# Altium schematic sheet Mobile_device_sheet6_interfaces.SchDoc
size A4; SheetNumber: 5; SheetTotal: 5
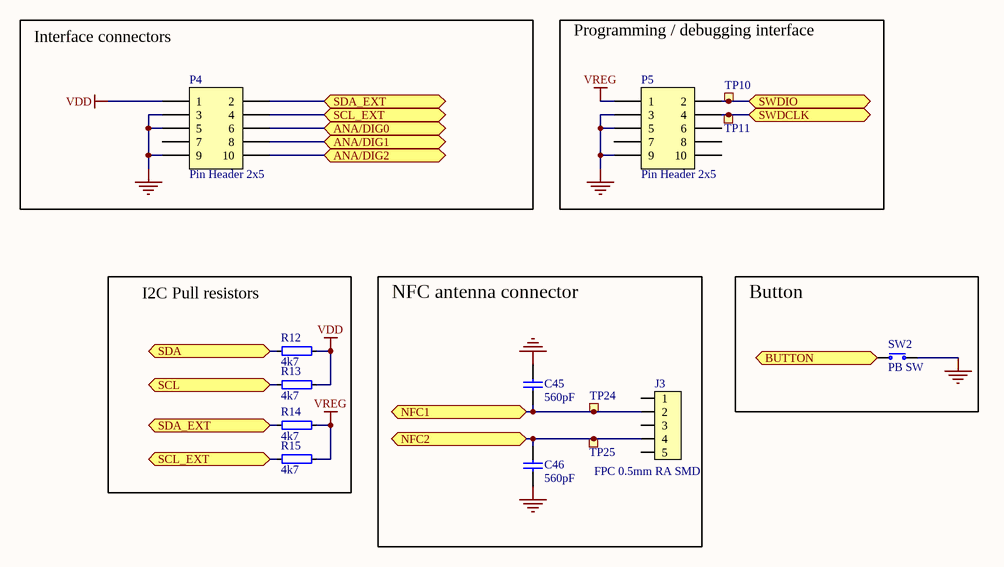
[diagram p0: Mobile_device_sheet6_interfaces.SchDoc]

## Parts
C45  560pF  [CAPC1005X04L]
C46  560pF  [CAPC1005X04L]
J3  FPC 0.5mm RA SMD  [FPC_05P-0.5mm-RA-SMD]
P4  Pin Header 2x5  [HDR_2x5-SMD-1.27mm-ANG]
P5  Pin Header 2x5  [HDR_2x5-SMD-1.27mm-ANG]
R12  4k7  [RESC1005X04L]
R13  4k7  [RESC1005X04L]
R14  4k7  [RESC1005X04L]
R15  4k7  [RESC1005X04L]
SW2  PB SW  [Switch-PB-6.2x6.3mm-SMD]
TP10  Ø1.5mm,SMD  [TP_SMD_Ø1.5mm]  (value not drawn)  (no BOM)
TP11  Ø1.5mm,SMD  [TP_SMD_Ø1.5mm]  (value not drawn)  (no BOM)
TP24  Ø1.0mm,SMD  [TP_SMD_Ø1.0mm]  (value not drawn)  (no BOM)
TP25  Ø1.0mm,SMD  [TP_SMD_Ø1.0mm]  (value not drawn)  (no BOM)

## Blocks framed on the sheet
Interface connectors: P4
Programming / debugging interface: P5 TP10 TP11
I2C Pull resistors: R12-R15
NFC antenna connector: C45 C46 J3 TP24 TP25
Button: SW2

## Ports
ANA/DIG0 (bidir), ANA/DIG1 (bidir), ANA/DIG2 (bidir), BUTTON (bidir), NFC1 (bidir), NFC2 (bidir), SCL (bidir), SCL_EXT (bidir), SDA (bidir), SDA_EXT (bidir), SWDCLK (bidir), SWDIO (bidir)

## Nets
GND: C45.2 C46.1 P4.3 P4.5 P4.9 P5.3 P5.5 P5.9 SW2.1(N.O)
VDD: P4.1 R12.1 R13.1
VREG: P5.1 R14.1 R15.1
ANA/DIG0: P4.6 ; port ANA/DIG0
ANA/DIG1: P4.8 ; port ANA/DIG1
ANA/DIG2: P4.10 ; port ANA/DIG2
BUTTON: SW2.2(COM) ; port BUTTON
NFC1: C45.1 J3.2 TP24.1 ; port NFC1
NFC2: C46.2 J3.4 TP25.1 ; port NFC2
SCL: R13.2 ; port SCL
SCL_EXT: P4.4 R15.2 ; port SCL_EXT
SDA: R12.2 ; port SDA
SDA_EXT: P4.2 R14.2 ; port SDA_EXT
SWDCLK: P5.4 TP11.1 ; port SWDCLK
SWDIO: P5.2 TP10.1 ; port SWDIO

Not connected (* = marked no-connect by the designer): J3 1 3 5; P4 7; P5 6 7 8 10

## Library data of the parts
C45 C46 = C0402-560p: Capacitor, NP0, ±5%; Part number IPS: N.A.; Note: 50V; Artikkelnr Noca: 20029161; Part Number: C0402-560p; Manufacturer: *; Manufacturer Part Number: *; Footprint Doc: 0402; LatestRevisionDate: 2009-05-08; Pin Count: 2; Publisher: Nordic Semiconductor; Published: 2009-05-08; Value: 560pF; ComponentLink1URL: *; ComponentLink1Description: Datasheet; ComponentLink2URL: *; ComponentLink2Description: Supplier link; HelpURL: *; Supplier 1: *; Supplier Part Number 1: *; Supplier 2: *; Supplier Part Number 2: *
J3 = FPC_05P-0.5mm-RA-SMD: 0.5mm FPC, 5P,Right Angle SMT,Double Contact,H=1.2mm,White, Tin plated; Manufacturer: W-CON; Manufacturer Part Number: 5141-05RZDNWR01; Part number IPS: 00000007792; Artikkelnr Noca: 55010020; Part Number: FPC_05P-0.5mm-RA-SMD; Footprint Doc: FPC_05P-0.5mm-RA-SMD; LatestRevisionDate: 2016-04-21; Pin Count: 7; Publisher: Nordic Semiconductor; Published: 2015-06-22; Value: FPC 0.5mm RA SMD; Note: *; ComponentLink1URL: *; ComponentLink1Description: Datasheet; ComponentLink2URL: *; ComponentLink2Description: Supplier link; HelpURL: \\hizz\pro\app9717\Datasheet\connectores\W-CON\5141-XXRZDNXX0X.pdf; Supplier 1: Cabcon; Supplier Part Number 1: 5141-05RZDNWR01; Supplier 2: Digi-Key; Supplier Part Number 2: WM9836CT-ND
P4 P5 = Pin Header 2x5 SMD, 1.27mm, Angled: Pin Header 2x5, 1.27mm (50mil); Manufacturer: Samtec; Manufacturer Part Number: FTSH-105-01-L-DH-A-C-TR; Part number IPS: 00000007800; Artikkelnr Noca: N.A.; Part Number: Pin Header 2x5 SMD, 1.27mm, Angled; LatestRevisionDate: 2014-01-22; Pin Count: 10; Publisher: Nordic Semiconductor; Published: 2014-01-22; Value: Pin Header 2x5; Note: *; Footprint Doc: HDR_2x5-SMD-1.27mm-ANG; ComponentLink1URL: *; ComponentLink1Description: Datasheet; ComponentLink2URL: *; ComponentLink2Description: Supplier link; HelpURL: http://www.samtec.com/documents/webfiles/pdf/FTSH_SMT.PDF; Supplier 1: Samtec; Supplier Part Number 1: FTSH-105-01-L-DH-A-C-TR; Supplier 2: *; Supplier Part Number 2: *
R12-R15 = R0402-4k7: Resistor, ±1%, 0.063W; Part number IPS: 00000003433; Note: Chip Res 1%; Artikkelnr Noca: 27049089; Part Number: R0402-4k7; Manufacturer: *; Manufacturer Part Number: *; Footprint Doc: 0402; LatestRevisionDate: 2009-11-23; Pin Count: 2; Publisher: Nordic Semiconductor; Published: 2009-05-08; Value: 4k7; ComponentLink1URL: *; ComponentLink1Description: Datasheet; ComponentLink2URL: *; ComponentLink2Description: Supplier link; HelpURL: *; Supplier 1: Farnell; Supplier Part Number 1: 173-8858; Supplier 2: *; Supplier Part Number 2: *
SW2 = Switch-PB-6.2x6.3mm-SMD: Tactile Switch, SPNO, SMD, 160gf, 6.2x6.3x2.5mm; Manufacturer: Dailywell; Manufacturer Part Number: TS604VM1-025BR-R; Part number IPS: 00000007812; Artikkelnr Noca: 50019106; Part Number: Switch-PB-6.2x6.3mm-SMD; Footprint Doc: Switch-PB-6.2x6.3mm-SMD; LatestRevisionDate: 2016-04-21; Pin Count: 4; Publisher: Nordic Semiconductor; Published: 2010-02-01; Value: PB SW; Note: *; ComponentLink1URL: *; ComponentLink1Description: Datasheet; ComponentLink2URL: *; ComponentLink2Description: Supplier link; HelpURL: \\hizz\pro\app9717\Datasheet\switches\Dailywell\TS604VM1-025BR-R.pdf; Supplier 1: Cabcon; Supplier Part Number 1: TS604VM1-025BR-R; Supplier 2: Mouser; Supplier Part Number 2: 688-SKHUALE010
TP10 TP11 = TP_SMD_Ø1.5MM: 1.0mm circular SMD testpad; Manufacturer: Nordic Semiconductor; Artikkelnr Noca: N.A.; Part Number: TP_SMD_Ø1.5MM; Manufacturer Part Number: *; Footprint Doc: TP_SMD_Ø1.5mm; LatestRevisionDate: 2016-06-02; Pin Count: 1; Publisher: Nordic Semiconductor; Published: 2016-06-02; Value: Ø1.5mm,SMD; Note: *; Part number IPS: N.A.; ComponentLink1URL: *; ComponentLink1Description: Datasheet; ComponentLink2URL: *; ComponentLink2Description: Supplier link; HelpURL: *; Supplier 1: *; Supplier Part Number 1: *; Supplier 2: *; Supplier Part Number 2: *
TP24 TP25 = TP_SMD_Ø1.0MM: 1.0mm circular SMD testpad; Manufacturer: Nordic Semiconductor; Artikkelnr Noca: N.A.; Part Number: TP_SMD_Ø1.0MM; Manufacturer Part Number: *; Footprint Doc: TP_SMD_Ø1.0mm; LatestRevisionDate: 2013-06-11; Pin Count: 1; Publisher: Nordic Semiconductor; Published: 2013-06-11; Value: Ø1.0mm,SMD; Note: *; Part number IPS: N.A.; ComponentLink1URL: *; ComponentLink1Description: Datasheet; ComponentLink2URL: *; ComponentLink2Description: Supplier link; HelpURL: *; Supplier 1: *; Supplier Part Number 1: *; Supplier 2: *; Supplier Part Number 2: *